# EAGLE design 01 (EAGLE 8.3.2)
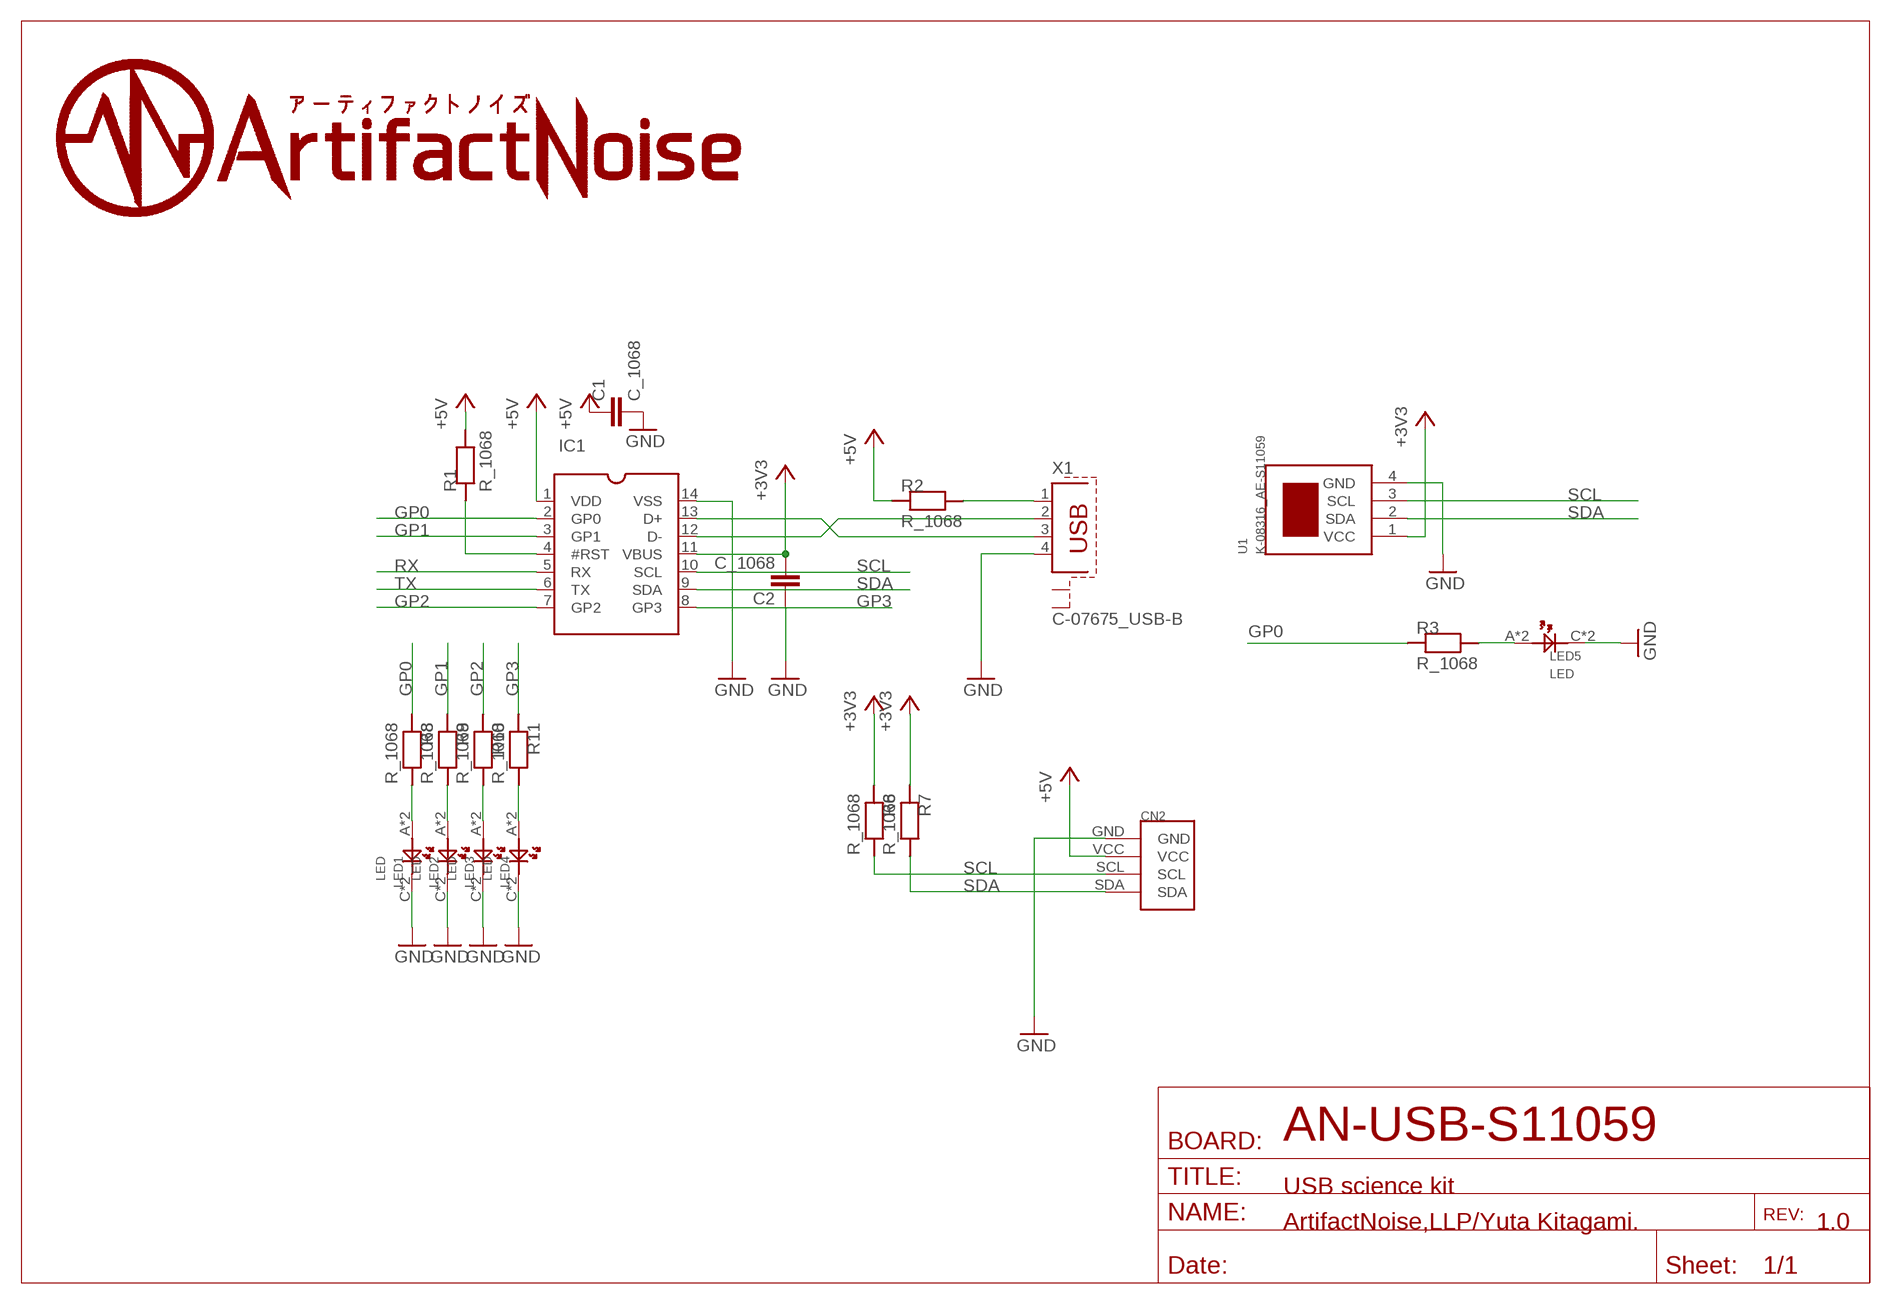
[diagram p0: schematic, sheet 1]

## Parts
C1  C_1068  [C0603]
C2  C_1068  [C0603]
CN2  PIN4  [PIN4]
IC1  _MCP2221A-I/PS  [SOCKET-14]
LED1  LED  [CHIPLED_0805]
LED2  LED  [CHIPLED_0805]
LED3  LED  [CHIPLED_0805]
LED4  LED  [CHIPLED_0805]
LED5  LED  [CHIPLED_0805]
R1  R_1068  [R0603]
R2  R_1068  [R0603]
R3  R_1068  [R0603]
R6  R_1068  [R0603]
R7  R_1068  [R0603]
R8  R_1068  [R0603]
R9  R_1068  [R0603]
R10  R_1068  [R0603]
R11  R_1068  [R0603]
U1  K-08316_AE-S11059  [AE-S11059]
X1  C-07675_USB-B  [PN61729-S]

## Nets
+3V3: C2.2 C2.D2 IC1.11(VBUS) R6.1 R6.D1 R7.1 R7.D1 U1.1(VCC)
+5V: C1.1 C1.D1 CN2.VCC IC1.1(VDD) R1.2 R1.D2 R2.1 R2.D1
GND: C1.2 C1.D2 C2.1 C2.D1 CN2.GND IC1.14(VSS) LED1.C LED1.DC(C) LED2.C LED2.DC(C) LED3.C LED3.DC(C) LED4.C LED4.DC(C) LED5.C LED5.DC(C) U1.4(GND) X1.4
GP0: IC1.2(GP0) R3.1 R3.D1 R8.1 R8.D1
GP1: IC1.3(GP1) R9.1 R9.D1
GP2: IC1.7(GP2) R10.1 R10.D1
GP3: IC1.8(GP3) R11.1 R11.D1
N$1: IC1.4(#RST) R1.1 R1.D1
N$2: IC1.13(D+) X1.3
N$3: IC1.12(D-) X1.2
N$4: LED5.A LED5.DA(A) R3.2 R3.D2
N$5: R2.2 R2.D2 X1.1
N$9: LED1.A LED1.DA(A) R8.2 R8.D2
N$10: LED2.A LED2.DA(A) R9.2 R9.D2
N$11: LED3.A LED3.DA(A) R10.2 R10.D2
N$12: LED4.A LED4.DA(A) R11.2 R11.D2
RX: IC1.5(RX)
SCL: CN2.SCL IC1.10(SCL) R6.2 R6.D2 U1.3(SCL)
SDA: CN2.SDA IC1.9(SDA) R7.2 R7.D2 U1.2(SDA)
TX: IC1.6(TX)
Unconnected: X1.S1 X1.S2

## Notes on the sheet
- AN-USB-S11059
- USB science kit
- ArtifactNoise,LLP/Yuta Kitagami. | 1.0

## Library data of the parts
C1 C2 = 01:C_1068
CN2 = 01:PIN4
IC1 = 01:_MCP2221A-I/P: Dual In Line / Socket
LED1-LED5 = 01:LED
R1-R3 R6-R11 = 01:R_1068
U1 = 01:K-08316_AE-S11059
X1 = 01:C-07675_USB-B: BERG USB connector; OC_FARNELL: unknown; OC_NEWARK: unknown

## Board
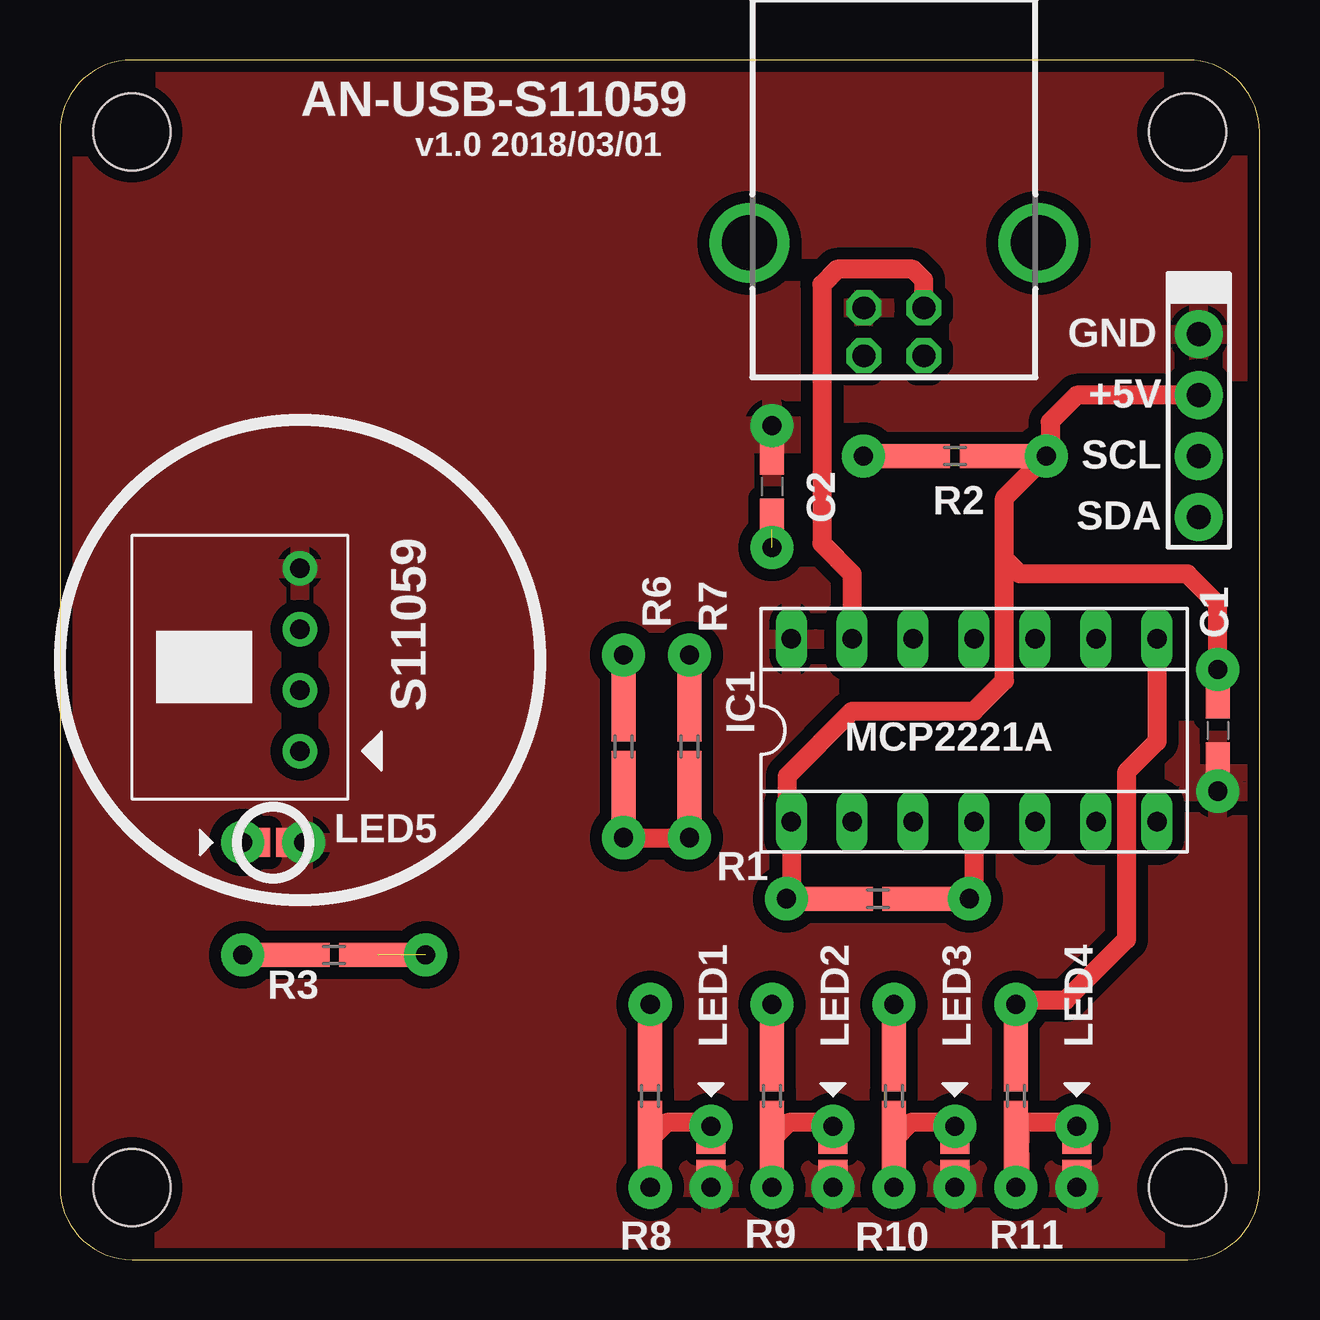
[diagram p1: board, top side]
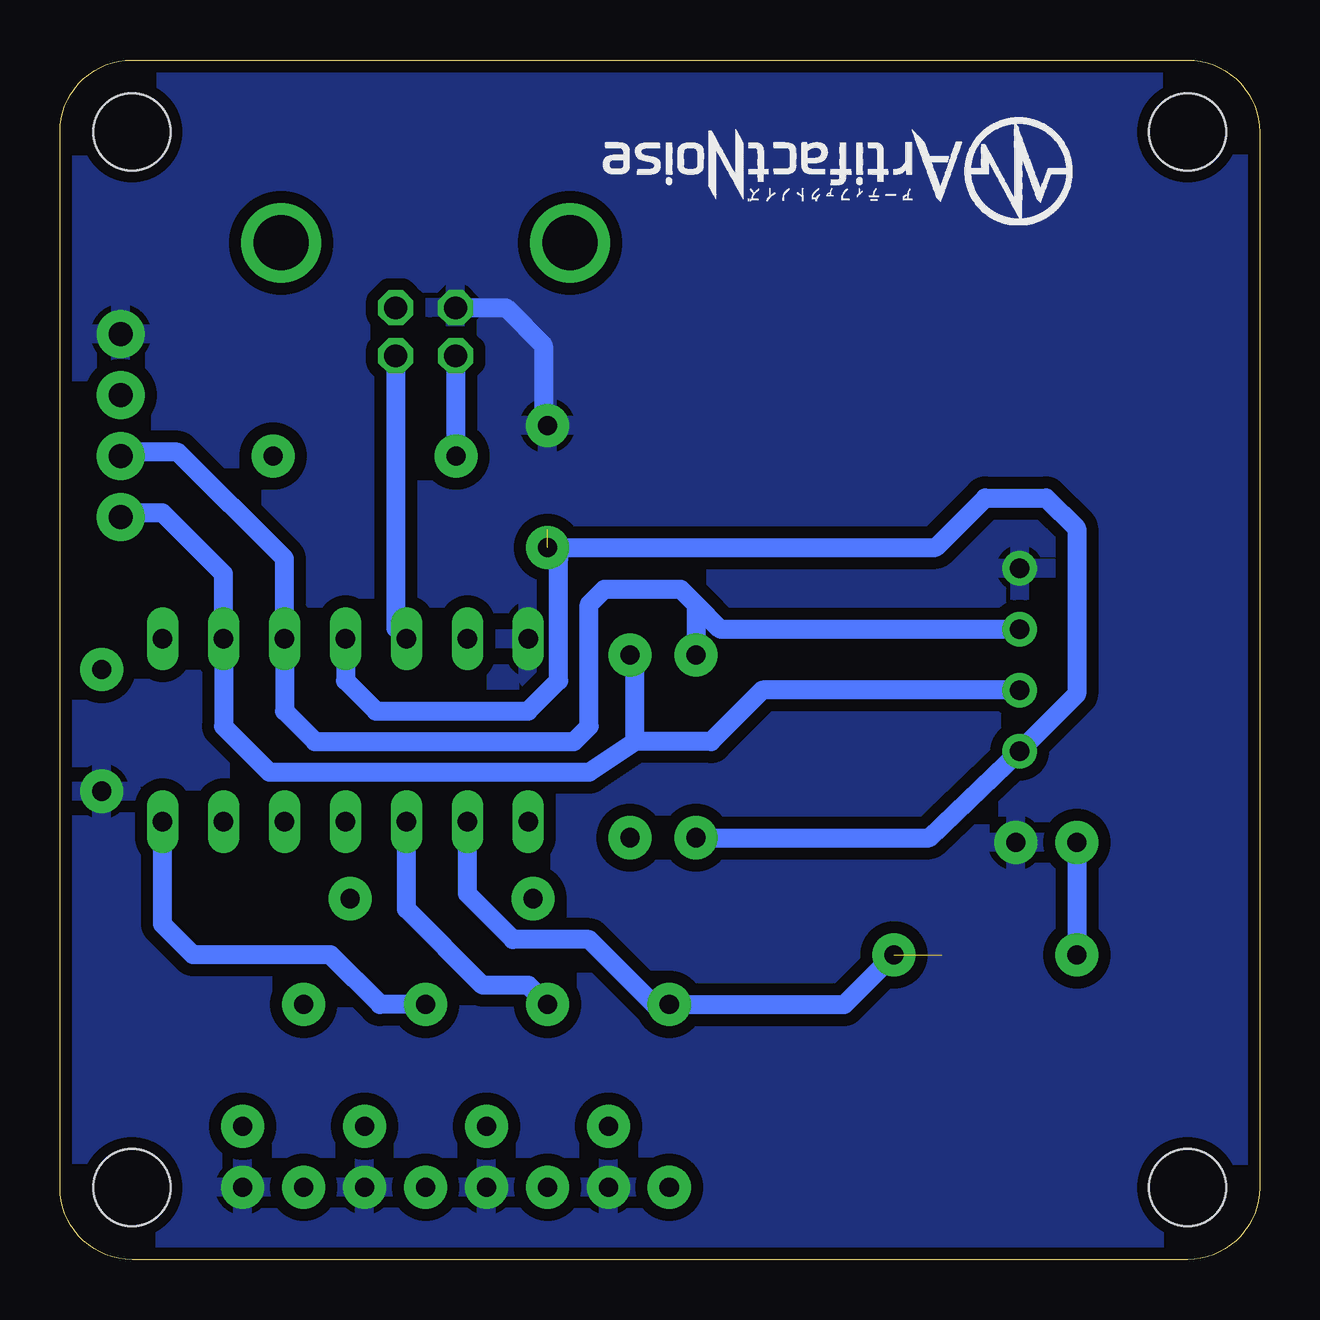
[diagram p2: board, bottom side, seen from below]

Size 50 x 50 mm. Coordinates in mm from the lower left corner, seen from the top.
Outline: 50,3 50,47 arc90 47,50 3,50 arc90 0,47 0,3 arc90 3,0 47,0 arc90 50,3
Copper layers (1*16): Top 0.035mm / dielectric 1.5mm / Bottom 0.035mm
Design rules "SeeedStudio_2layer_DRU_no_angle_20140221a": minimum track width 6mil, minimum drill 12mil, track to track 6mil, track to pad 6mil, pad to pad 6mil, via to via 6mil, smd to smd 0mil, copper to edge 10mil, drill to drill 10mil, minimum pad ring 10mil, minimum via ring 6mil, stop-mask expansion 2mil, vias tented up to drill 25mil, thermal gap 10mil
Holes 3.2 mm at 47,47 3,47 3,3 47,3

### Footprints (pad centres in the part's own frame; a part is rotated, then mirrored left to right if it is on the bottom)
C0603 = smd 2.6 x 1: 1 -1.8,0; 2 1.8,0 | drill 0.8 pad 1.8: D1 -2.54,0; D2 2.54,0
PIN4 = drill 1 pad 2: GND 0,-3.81; SCL 0,1.27; SDA 0,3.81; VCC 0,-1.27
SOCKET-14 = drill 0.813 long: 1 -7.62,-3.81; 2 -5.08,-3.81; 3 -2.54,-3.81; 4 0,-3.81; 5 2.54,-3.81; 6 5.08,-3.81; 7 7.62,-3.81; 8 7.62,3.81; 9 5.08,3.81; 10 2.54,3.81; 11 0,3.81; 12 -2.54,3.81; 13 -5.08,3.81; 14 -7.62,3.81
CHIPLED_0805 = smd 1.2 x 0.8: A 0,-1.8; C 0,-0.74 | drill 0.8 pad 1.8: DA 0,-2.54; DC 0,0
R0603 = smd 3.2 x 1: 1 -1.8,0; 2 1.8,0 | drill 0.8 pad 1.8: D1 -3.81,0; D2 3.81,0
AE-S11059 = drill 0.8 pad 1.422: 1 -3.81,0; 2 -1.27,0; 3 1.27,0; 4 3.81,0
PN61729-S = drill 0.95 octagon: 1 1.25,4.71; 2 -1.25,4.71; 3 -1.25,2.71; 4 1.25,2.71 | drill 2.3 pad 2.9: S1 -6.02,0; S2 6.02,0

### Placement (x,y rotation side)
C1  48.26,22.06 270 top
C2  29.68,32.22 270 top
CN2  47.46,34.76 180 top
IC1  38.1,22.06 0 top
LED1  27.14,3.01 180 top
LED2  32.22,3.01 180 top
LED3  37.3,3.01 180 top
LED4  42.38,3.01 180 top
LED5  10.16,17.38 270 top
R1  34.09,15.04 180 top
R2  37.3,33.49 180 top
R3  11.43,12.7 180 top
R6  23.5,21.39 90 top
R7  26.23,21.39 90 top
R8  24.6,6.82 270 top
R9  29.68,6.82 270 top
R10  34.76,6.82 270 top
R11  39.84,6.82 270 top
U1  10,25 90 top
U$1  [AN-LOGO2]  7.8,47.6 180 bottom
X1  34.76,42.38 180 top

### Tracks (layer width: path | path; a pad name or v marks a point on that pad's centre or on a via)
+3V3  (1 unrouted)
  Top 0.8: R6.D1 24.13,17.58 | 24.13,17.58 R7.D1 R7.1 | R6.1 23.5,18.21 24.13,17.58
  Bottom 0.8: IC1.11 38.1,24.13 36.83,22.86 30.48,22.86 29.21,24.13 29.21,29.21 C2.D2 13.5,29.68 11.43,31.75 8.89,31.75 7.62,30.48 7.62,23.57 U1.1 13.77,17.58 R6.D1
+5V
  Top 0.8: R2.1 R2.D1 | CN2.VCC 42.38,36.03 41.27,34.92 41.27,33.66 R2.D1 | C1.1 C1.D1 48.26,27.3 46.99,28.57 40.01,28.57 39.37,29.21 | 39.37,29.21 39.37,24.13 38.1,22.86 33.02,22.86 30.32,20.16 30.32,18.41 IC1.1 30.48,15.24 R1.D2 R1.2 | 39.37,29.21 39.37,31.75 R2.D1
GND
  Top 0.8: LED4.C LED4.DC | LED5.C LED5.DC
  Bottom 0.8: X1.4 31.41,39.67 29.84,38.1 29.84,34.92 C2.D1
  pour Top (isolate 0.5): 51.27,-0.8 -0.8,-0.8 -0.8,51.27 51.27,51.27
  pour Bottom (isolate 0.5): 51.27,-0.8 -0.8,-0.8 -0.8,51.27 51.27,51.27
GP0  (1 unrouted)
  Top 0.8: R8.1 R8.D1
  Bottom 0.8: IC1.2 33.02,15.24 31.11,13.34 27.94,13.34 25.23,10.63 R8.D1 17.31,10.63 R3.D1
GP1
  Top 0.8: R9.1 R9.D1
  Bottom 0.8: R9.D1 30.48,11.43 32.38,11.43 35.56,14.61 IC1.3
GP2
  Top 0.8: R10.1 R10.D1
  Bottom 0.8: R10.D1 36.66,10.63 38.73,12.7 44.45,12.7 45.72,13.97 IC1.7
GP3
  Top 0.8: IC1.8 45.72,21.59 44.45,20.32 44.45,13.34 41.91,10.79 40.01,10.79 R11.D1 R11.1
N$1
  Top 0.8: IC1.4 38.1,15.24 R1.D1 R1.1
N$2
  Top 0.8: X1.3 36.01,40.83 35.56,41.27 32.38,41.27 31.75,40.64 31.75,29.84 33.02,28.57 IC1.13
N$3
  Bottom 0.8: X1.2 36.01,26.32 IC1.12
N$4
  Top 0.8: R3.2 R3.D2
  Bottom 0.8: LED5.DA R3.D2
N$5
  Top 0.8: R2.D2 R2.2
  Bottom 0.8: X1.1 33.51,33.51 R2.D2
N$9
  Top 0.8: LED1.A LED1.DA 27.3,5.71 25.3,5.71 R8.2 R8.D2
N$10
  Top 0.8: LED2.A LED2.DA 32.38,5.71 30.38,5.71 R9.2 R9.D2
N$11
  Top 0.8: LED3.A LED3.DA 37.47,5.71 35.45,5.71 R10.2 34.76,3.98 34.92,3.17 R10.D2
N$12
  Top 0.8: LED4.A LED4.DA 42.55,5.71 40.01,5.71 40.01,4.86 | R11.D2 40.01,3.17 40.01,4.45 40.01,4.86 | 40.01,4.86 R11.2
SCL
  Top 0.8: R6.2 R6.D2
  Bottom 0.8: 23.5,27.3 24.13,27.94 27.3,27.94 27.94,27.3 27.94,22.23 28.57,21.59 39.37,21.59 40.64,22.86 IC1.10 40.64,29.21 45.09,33.66 47.3,33.66 CN2.SCL | 23.5,27.3 R6.D2 | U1.3 22.46,26.27 23.5,27.3
SDA
  Top 0.8: R7.2 R7.D2
  Bottom 0.8: CN2.SDA 47.3,31.11 45.72,31.11 43.18,28.57 IC1.9 43.18,22.23 41.27,20.32 27.94,20.32 26.04,21.59 | 26.04,21.59 26.04,25 R7.D2 | U1.2 20.72,23.73 22.86,21.59 26.04,21.59

### Text on the board
tPlace: AN-USB-S11059 | v1.0 2018/03/01 | GND | +5V | SCL | SDA | S11059 | MCP2221A